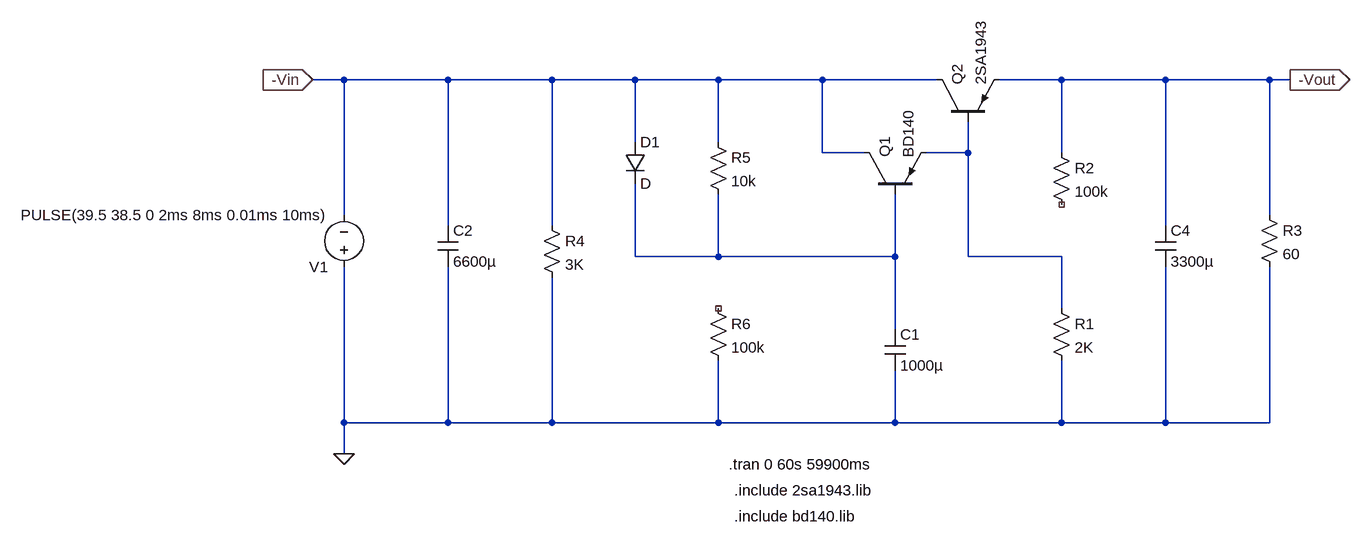
[diagram p0: schematic ripple_filter_neg_bipolar.asc]
ripple_filter_neg_bipolar.asc, the LTspice schematic file:
Version 4
SHEET 1 1176 784
WIRE -736 96 -784 96
WIRE -576 96 -736 96
WIRE -416 96 -576 96
WIRE -288 96 -416 96
WIRE -160 96 -288 96
WIRE 0 96 -160 96
WIRE 176 96 0 96
WIRE 368 96 272 96
WIRE 528 96 368 96
WIRE 688 96 528 96
WIRE 720 96 688 96
WIRE -288 192 -288 96
WIRE -160 192 -160 96
WIRE 0 208 0 96
WIRE 64 208 0 208
WIRE 224 208 224 160
WIRE 224 208 160 208
WIRE 368 208 368 96
WIRE -736 304 -736 96
WIRE 688 304 688 96
WIRE -576 320 -576 96
WIRE -416 320 -416 96
WIRE 528 320 528 96
WIRE -288 368 -288 256
WIRE -160 368 -160 272
WIRE -160 368 -288 368
WIRE 112 368 112 272
WIRE 112 368 -160 368
WIRE 224 368 224 208
WIRE 368 368 224 368
WIRE 368 448 368 368
WIRE 112 480 112 368
WIRE -736 624 -736 384
WIRE -576 624 -576 384
WIRE -576 624 -736 624
WIRE -416 624 -416 400
WIRE -416 624 -576 624
WIRE -160 624 -160 528
WIRE -160 624 -416 624
WIRE 112 624 112 544
WIRE 112 624 -160 624
WIRE 368 624 368 528
WIRE 368 624 112 624
WIRE 528 624 528 384
WIRE 528 624 368 624
WIRE 688 624 688 384
WIRE 688 624 528 624
WIRE -736 672 -736 624
FLAG -736 672 0
FLAG -784 96 -Vin
IOPIN -784 96 In
FLAG 720 96 -Vout
IOPIN 720 96 Out
SYMBOL cap 96 480 R0
SYMATTR InstName C1
SYMATTR Value 1000µ
SYMBOL res 672 288 R0
SYMATTR InstName R3
SYMATTR Value 60
SYMBOL voltage -736 400 R180
WINDOW 123 0 0 Left 0
WINDOW 39 0 0 Left 0
SYMATTR InstName V1
SYMATTR Value PULSE(39.5 38.5 0 2ms 8ms 0.01ms 10ms)
SYMBOL pnp 64 272 R270
SYMATTR InstName Q1
SYMATTR Value BD140
SYMATTR Prefix X
SYMBOL pnp 176 160 R270
SYMATTR InstName Q2
SYMATTR Value 2SA1943
SYMATTR Prefix X
SYMBOL cap -592 320 R0
SYMATTR InstName C2
SYMATTR Value 6600µ
SYMBOL res -432 304 R0
SYMATTR InstName R4
SYMATTR Value 3K
SYMBOL res -176 176 R0
SYMATTR InstName R5
SYMATTR Value 10k
SYMBOL res -176 432 R0
SYMATTR InstName R6
SYMATTR Value 100k
SYMBOL res 352 432 R0
SYMATTR InstName R1
SYMATTR Value 2K
SYMBOL cap 512 320 R0
SYMATTR InstName C4
SYMATTR Value 3300µ
SYMBOL diode -304 192 R0
SYMATTR InstName D1
SYMBOL res 352 192 R0
SYMATTR InstName R2
SYMATTR Value 100k
TEXT -144 688 Left 2 !.tran 0 60s 59900ms
TEXT -136 728 Left 2 !.include 2sa1943.lib
TEXT -136 768 Left 2 !.include bd140.lib

The netlist it stands for:
* ripple_filter_neg_bipolar.asc
C1 N002 0 1000µ
R3 -Vout 0 60
V1 0 -Vin PULSE(39.5 38.5 0 2ms 8ms 0.01ms 10ms)
XQ1 -Vin N002 N001 BD140  ; pins C B E
XQ2 -Vin N001 -Vout 2SA1943  ; pins C B E
C2 -Vin 0 6600µ
R4 -Vin 0 3K
R5 -Vin N002 10k
R6 NC_01 0 100k
R1 N001 0 2K
C4 -Vout 0 3300µ
D1 -Vin N002 D
R2 -Vout NC_02 100k
.model D D
.lib standard.dio
.tran 0 60s 59900ms
.include 2sa1943.lib
.include bd140.lib
.backanno
.end